# Altium schematic sheet P_ETH_HPS.SchDoc
size 209 x 297 mm; Author: ALTIUM GOSTBOM2.0 KEV; SheetNumber: 21; SheetTotal: 48
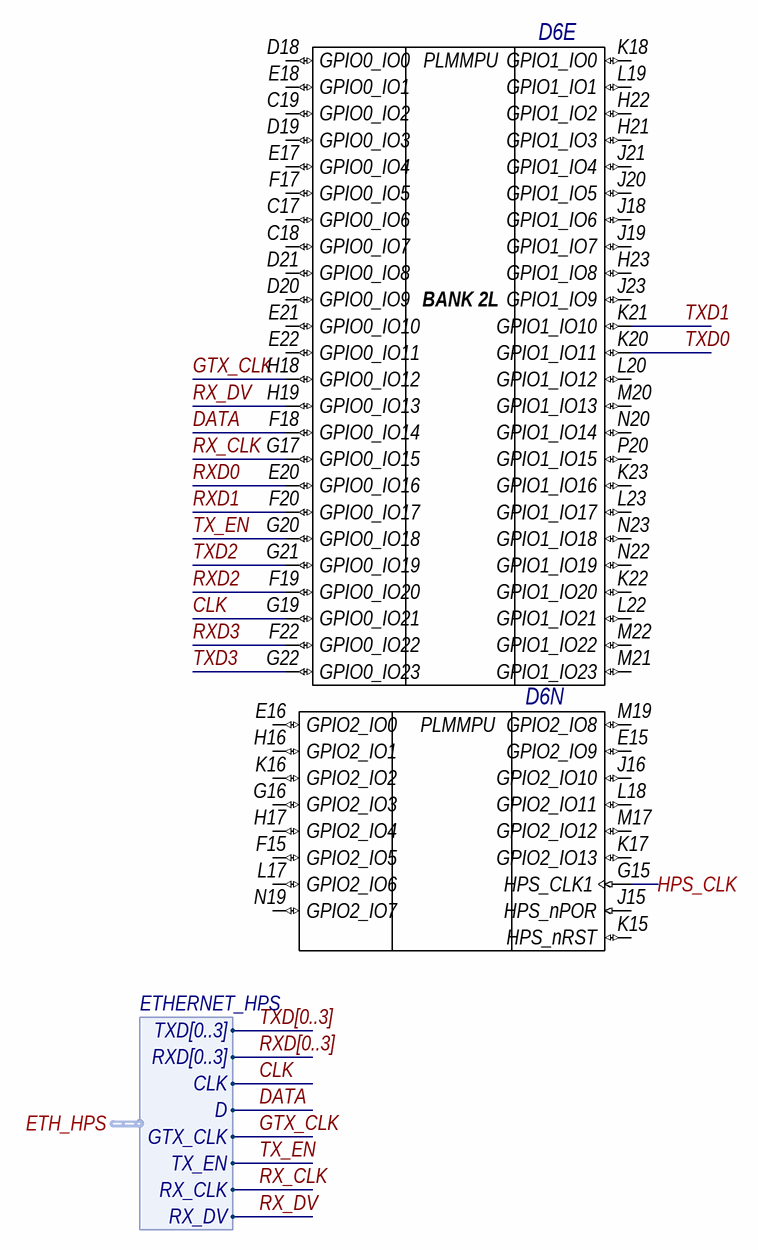
[diagram p0: P_ETH_HPS.SchDoc]

## Parts
D6  10AS066N3F40E2SGE2  [ALTR-FBGA1517_A-350]  (value not drawn)  (parts E,N of 39)

## Ports
ETH_HPS (harness ETHERNET_HPS), HPS_CLK

## Harnesses
ETHERNET_HPS: TXD[0..3], RXD[0..3], CLK, D, GTX_CLK, TX_EN, RX_CLK, RX_DV

## Nets
CLK: D6.G19(GPIO0_IO21) ; port ETH_HPS.CLK
DATA: D6.F18(GPIO0_IO14) ; port ETH_HPS.D
GTX_CLK: D6.H18(GPIO0_IO12) ; port ETH_HPS.GTX_CLK
HPS_CLK: D6.G15(HPS_CLK1) ; port HPS_CLK
RX_CLK: D6.G17(GPIO0_IO15) ; port ETH_HPS.RX_CLK
RX_DV: D6.H19(GPIO0_IO13) ; port ETH_HPS.RX_DV
RXD0: D6.E20(GPIO0_IO16)
RXD1: D6.F20(GPIO0_IO17)
RXD2: D6.F19(GPIO0_IO20)
RXD3: D6.F22(GPIO0_IO22)
TX_EN: D6.G20(GPIO0_IO18) ; port ETH_HPS.TX_EN
TXD0: D6.K20(GPIO1_IO11)
TXD1: D6.K21(GPIO1_IO10)
TXD2: D6.G21(GPIO0_IO19)
TXD3: D6.G22(GPIO0_IO23)

Not connected (* = marked no-connect by the designer): D6 C17(GPIO0_IO6) C18(GPIO0_IO7) C19(GPIO0_IO2) D18(GPIO0_IO0) D19(GPIO0_IO3) D20(GPIO0_IO9) D21(GPIO0_IO8) E15(GPIO2_IO9) E16(GPIO2_IO0) E17(GPIO0_IO4) E18(GPIO0_IO1) E21(GPIO0_IO10) E22(GPIO0_IO11) F15(GPIO2_IO5) F17(GPIO0_IO5) G16(GPIO2_IO3) H16(GPIO2_IO1) H17(GPIO2_IO4) H21(GPIO1_IO3) H22(GPIO1_IO2) H23(GPIO1_IO8) J15(HPS_nPOR) J16(GPIO2_IO10) J18(GPIO1_IO6) J19(GPIO1_IO7) J20(GPIO1_IO5) J21(GPIO1_IO4) J23(GPIO1_IO9) K15(HPS_nRST) K16(GPIO2_IO2) K17(GPIO2_IO13) K18(GPIO1_IO0) K22(GPIO1_IO20) K23(GPIO1_IO16) L17(GPIO2_IO6) L18(GPIO2_IO11) L19(GPIO1_IO1) L20(GPIO1_IO12) L22(GPIO1_IO21) L23(GPIO1_IO17) M17(GPIO2_IO12) M19(GPIO2_IO8) M20(GPIO1_IO13) M21(GPIO1_IO23) M22(GPIO1_IO22) N19(GPIO2_IO7) N20(GPIO1_IO14) N22(GPIO1_IO19) N23(GPIO1_IO18) P20(GPIO1_IO15)

## Buses and harness runs
bus RXD[0..3]
bus TXD[0..3]

## Notes on the sheet
- Подп. дата
- Инв. № дубл.
- Взам. инв. №
- Подп. и дата
- Инв. № подл.
- Изм.
- Лист
- № докум.
- Подп.
- Дата
- Файл:
- ALTIUM GOSTBOM2.0 KEV
- Копировал
- Формат А4
- (in symbol E105, part E) PLMMPU; BANK 2L
- (in symbol E105, part N) PLMMPU

## Library data of the parts
D6 = E105: Arria 10 SX Family, 588 I/O Pins, 16 Fractional PLLs, 1517-Pin FBGA, Speed Grade 2, Extended Grade, RoHS; Тип элемента: ПЛИС; Old_des: U1; New_des: D6; UID: E105; Component Kind: Standard; ComponentLink1Description: Manufacturer URL; ComponentLink1URL: https://www.altera.com/; ComponentLink2Description: Datasheet; ComponentLink2URL: https://www.altera.com/content/dam/altera-www/global/en_US/pdfs/literature/hb/arria-10/a10_datasheet.pdf; DatasheetVersion: Rev. 2016-06-24, 06/2016; Mounting Technology: Surface Mount; PackageDescription: 1517-Pin FineLine Ball-Grid Array (FBGA), Body 40 x 40 mm, Pitch 1 mm; PartNumber: 10AS066N3F40E2SGE2; Code_JEDEC: MS-034; ComponentLink3Description: Package Specification; ComponentLink3URL: https://www.altera.com/content/dam/altera-www/global/en_US/pdfs/literature/packaging/04r00461-04.pdf; PackageVersion: Rev. 5.0, 01/2016